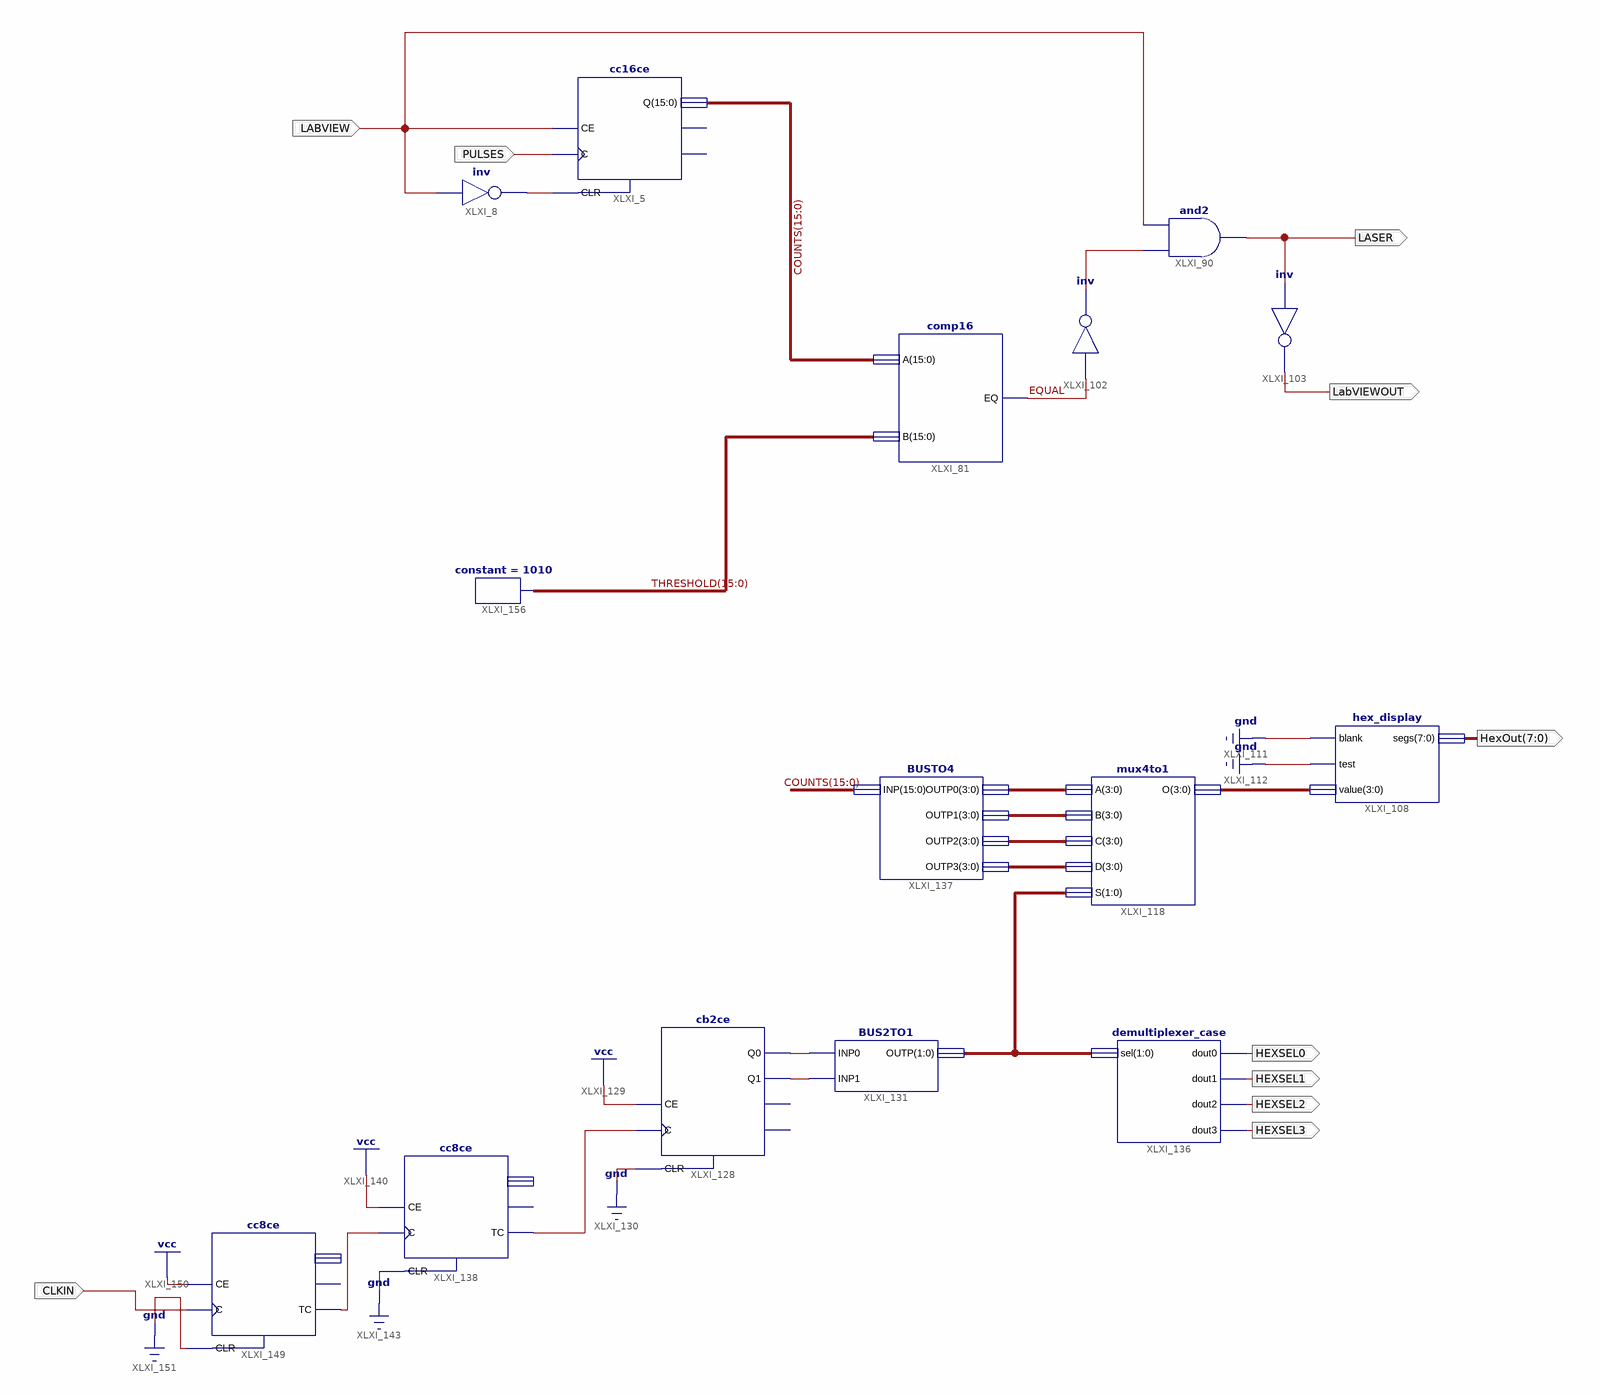
[diagram p0: schematic sheet 1]
// Xilinx ISE schematic MichaelsFPGAVision_troubleshooting.sch (spartan3) as structural Verilog: 15 symbols, 10 ports
module MichaelsFPGAVision_troubleshooting (
  input  LABVIEW,
  input  PULSES,
  input  CLKIN,
  output LASER,
  output LabVIEWOUT,
  output [7:0] HexOut,
  output HEXSEL0,
  output HEXSEL1,
  output HEXSEL2,
  output HEXSEL3
);

  wire EQUAL, XLXN_7, XLXN_141, XLXN_177, XLXN_178, XLXN_184, XLXN_196;
  wire [1:0] XLXN_179;
  wire [3:0] XLXN_158, XLXN_169, XLXN_170, XLXN_171, XLXN_172;
  wire [15:0] COUNTS, THRESHOLD;

  comp16 XLXI_81 (.A(COUNTS), .B(THRESHOLD), .EQ(EQUAL));
  not XLXI_8 (XLXN_7, LABVIEW);
  cc16ce XLXI_5 (.C(PULSES), .CE(LABVIEW), .CLR(XLXN_7), .Q(COUNTS));  // open: CEO, TC
  and XLXI_90 (LASER, XLXN_141, LABVIEW);
  not XLXI_102 (XLXN_141, EQUAL);
  not XLXI_103 (LabVIEWOUT, LASER);
  hex_display XLXI_108 (.blank(1'b0), .test(1'b0), .value(XLXN_158), .segs(HexOut));
  mux4to1 XLXI_118 (.A(XLXN_169), .B(XLXN_170), .C(XLXN_171), .D(XLXN_172), .S(XLXN_179), .O(XLXN_158));
  cb2ce XLXI_128 (.C(XLXN_184), .CE(1'b1), .CLR(1'b0), .Q0(XLXN_177), .Q1(XLXN_178));  // open: CEO, TC
  BUS2TO1 XLXI_131 (.INP0(XLXN_177), .INP1(XLXN_178), .OUTP(XLXN_179));
  demultiplexer_case XLXI_136 (.sel(XLXN_179), .dout0(HEXSEL0), .dout1(HEXSEL1), .dout2(HEXSEL2), .dout3(HEXSEL3));
  cc8ce XLXI_138 (.C(XLXN_196), .CE(1'b1), .CLR(1'b0), .TC(XLXN_184));  // open: CEO, Q
  cc8ce XLXI_149 (.C(CLKIN), .CE(1'b1), .CLR(1'b0), .TC(XLXN_196));  // open: CEO, Q
  BUSTO4 XLXI_137 (.INP(COUNTS), .OUTP0(XLXN_169), .OUTP1(XLXN_170), .OUTP2(XLXN_171), .OUTP3(XLXN_172));
  constant #(.CValue("1010")) XLXI_156 (.O(THRESHOLD));
endmodule
